# EAGLE design 2 layers (EAGLE 9.5.1)
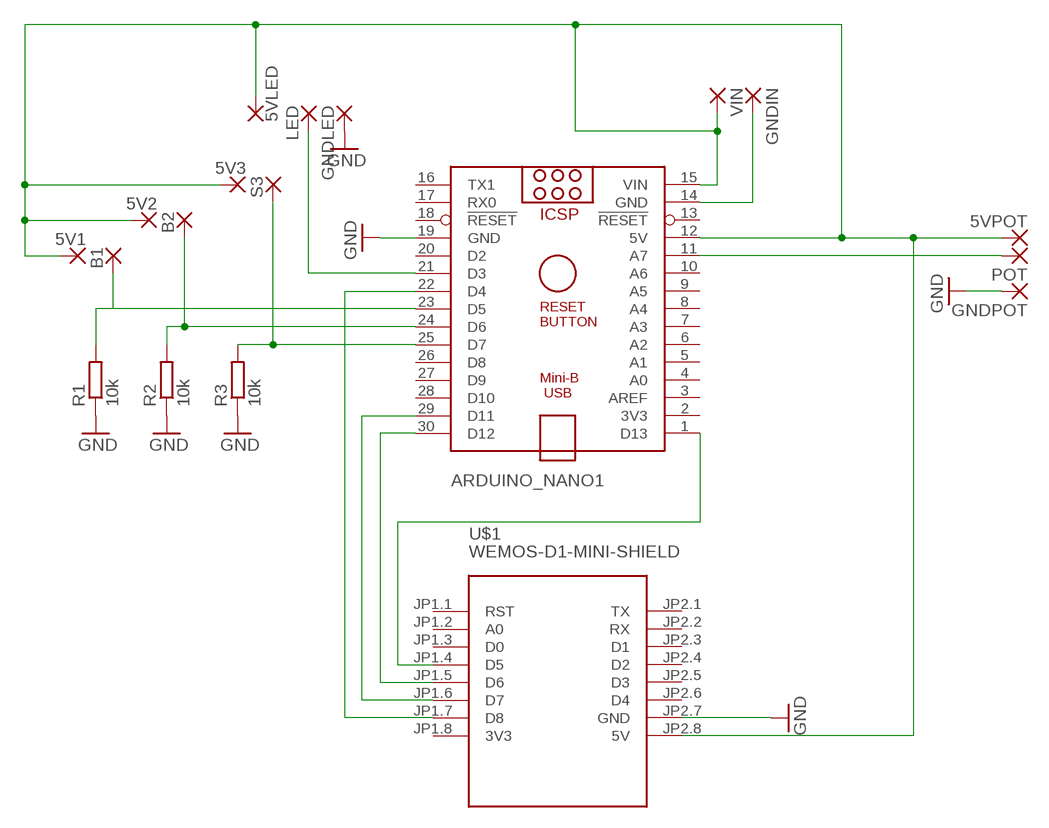
[diagram p0: schematic, sheet 1]

## Parts
5V1  1,6/0,8  [1,6/0,8]
5V2  1,6/0,8  [1,6/0,8]
5V3  1,6/0,8  [1,6/0,8]
5VLED  1,6/0,8  [1,6/0,8]
5VPOT  1,6/0,8  [1,6/0,8]
ARDUINO_NANO1  ARDUINO_NANO  [ARDUINO_NANO]
B1  1,6/0,8  [1,6/0,8]
B2  1,6/0,8  [1,6/0,8]
GNDIN  1,6/0,8  [1,6/0,8]
GNDLED  1,6/0,8  [1,6/0,8]
GNDPOT  1,6/0,8  [1,6/0,8]
LED  1,6/0,8  [1,6/0,8]
POT  1,6/0,8  [1,6/0,8]
R1  10k  R-EU_0207/7  [0207/7]
R2  10k  R-EU_0207/7  [0207/7]
R3  10k  R-EU_0207/7  [0207/7]
S3  1,6/0,8  [1,6/0,8]
U$1  WEMOS-D1-MINI-SHIELD  [WEMOS-D1-MINI-SHIELD]
VIN  1,6/0,8  [1,6/0,8]

## Nets
GND: ARDUINO_NANO1.19(GND) GNDLED.1(P) GNDPOT.1(P) R1.1 R2.1 R3.1 U$1.JP2.7(GND)
N$1: 5V1.1(P) 5V2.1(P) 5V3.1(P) 5VLED.1(P) 5VPOT.1(P) ARDUINO_NANO1.12(5V) ARDUINO_NANO1.15(VIN) U$1.JP2.8(5V) VIN.1(P)
N$2: ARDUINO_NANO1.14(GND) GNDIN.1(P)
N$3: ARDUINO_NANO1.11(A7) POT.1(P)
N$5: ARDUINO_NANO1.1(D13) U$1.JP1.4(D5)
N$6: ARDUINO_NANO1.30(D12) U$1.JP1.5(D6)
N$7: ARDUINO_NANO1.29(D11) U$1.JP1.6(D7)
N$8: ARDUINO_NANO1.25(D7) R3.2 S3.1(P)
N$9: ARDUINO_NANO1.22(D4) U$1.JP1.7(D8)
N$10: ARDUINO_NANO1.24(D6) B2.1(P) R2.2
N$11: ARDUINO_NANO1.23(D5) B1.1(P) R1.2
N$12: ARDUINO_NANO1.21(D3) LED.1(P)
Unconnected: ARDUINO_NANO1.2(3V3) ARDUINO_NANO1.3(AREF) ARDUINO_NANO1.4(A0) ARDUINO_NANO1.5(A1) ARDUINO_NANO1.6(A2) ARDUINO_NANO1.7(A3) ARDUINO_NANO1.8(A4) ARDUINO_NANO1.9(A5) ARDUINO_NANO1.10(A6) ARDUINO_NANO1.13(!RESET) ARDUINO_NANO1.16(TX1) ARDUINO_NANO1.17(RX0) ARDUINO_NANO1.18(!RESET) ARDUINO_NANO1.20(D2) ARDUINO_NANO1.26(D8) ARDUINO_NANO1.27(D9) ARDUINO_NANO1.28(D10) U$1.JP1.1(RST) U$1.JP1.2(A0) U$1.JP1.3(D0) U$1.JP2.1(TX) U$1.JP2.2(RX) U$1.JP2.3(D1) U$1.JP2.4(D2) U$1.JP2.5(D3) U$1.JP2.6(D4)

## Power pins joined to a net without a drawn wire
3V3: U$1.JP1.8(3V3)

## Library data of the parts
5V1-5V3 5VLED 5VPOT B1 B2 GNDIN GNDLED GNDPOT LED POT S3 VIN = wirepad:1,6/0,8: THROUGH-HOLE PAD
ARDUINO_NANO1 = ArduinoNanoV30:ARDUINO_NANO: Arduino Nano V3.0 Overview: The Arduino Nano is a small, complete, and breadboard-friendly board based on the ATmega328 (Arduino Nano 3.x) or ATmega168 (Arduino Nano 2.x). It has more or less the same functionality of the Arduino Duemilanove, but in a different package. It lacks only a DC power jack, and works with a Mini-B USB cable instead of a standard one. The Nano was designed and is being produced by Gravitech. Specifications: Microcontroller Atmel ATmega168 or ATmega328 Operating Voltage (logic level) 5 V Input Voltage (recommended) 7-12 V Input Voltage (limits) 6-20 V Digital I/O Pins 14 (of which 6 provide PWM output) Analog Input Pins 8 DC Current per I/O Pin 40 mA Flash Memory 16 KB (ATmega168) or 32 KB (ATmega328) of which 2 KB used by bootloader SRAM 1 KB (ATmega168) or 2 KB (ATmega328) EEPROM 512 bytes (ATmega168) or 1 KB (ATmega328) Clock Speed 16 MHz Dimensions 0.73" x 1.70" Length 45 mm Width 18 mm Weigth 5 g Power: The Arduino Nano can be powered via the Mini-B USB connection, 6-20V unregulated external power supply (pin 30), or 5V regulated external power supply (pin 27). The power source is automatically selected to the highest voltage source. Memory: The ATmega168 has 16 KB of flash memory for storing code (of which 2 KB is used for the bootloader); the ATmega328 has 32 KB, (also with 2 KB used for the bootloader). The ATmega168 has 1 KB of SRAM and 512 bytes of EEPROM (which can be read and written with the EEPROM library); the ATmega328 has 2 KB of SRAM and 1 KB of EEPROM. Input and Output: Each of the 14 digital pins on the Nano can be used as an input or output, using pinMode(), digitalWrite(), and digitalRead() functions. They operate at 5 volts. Each pin can provide or receive a maximum of 40 mA and has an internal pull-up resistor (disconnected by default) of 20-50 kOhms. In addition, some pins have specialized functions. Visit Arduino - ArduinoBoardNano <https://www.arduino.cc/en/Main/ArduinoBoardNano>
R1-R3 = resistor:R-EU_: RESISTOR, European symbol
U$1 = diy-modules:WEMOS-D1-MINI-SHIELD: Template for WEMOS D1 mini compatible shields NOTICE: This is a template only. You can use it as a base to create symbols for WEMOS D1 mini compatible shields. Official list of available shields can be found here: https://www.wemos.cc/D1-mini-Shields

## Net classes
0 default: width 0.4 mm, drill 0.6 mm, clearance 0.3 mm

## Board
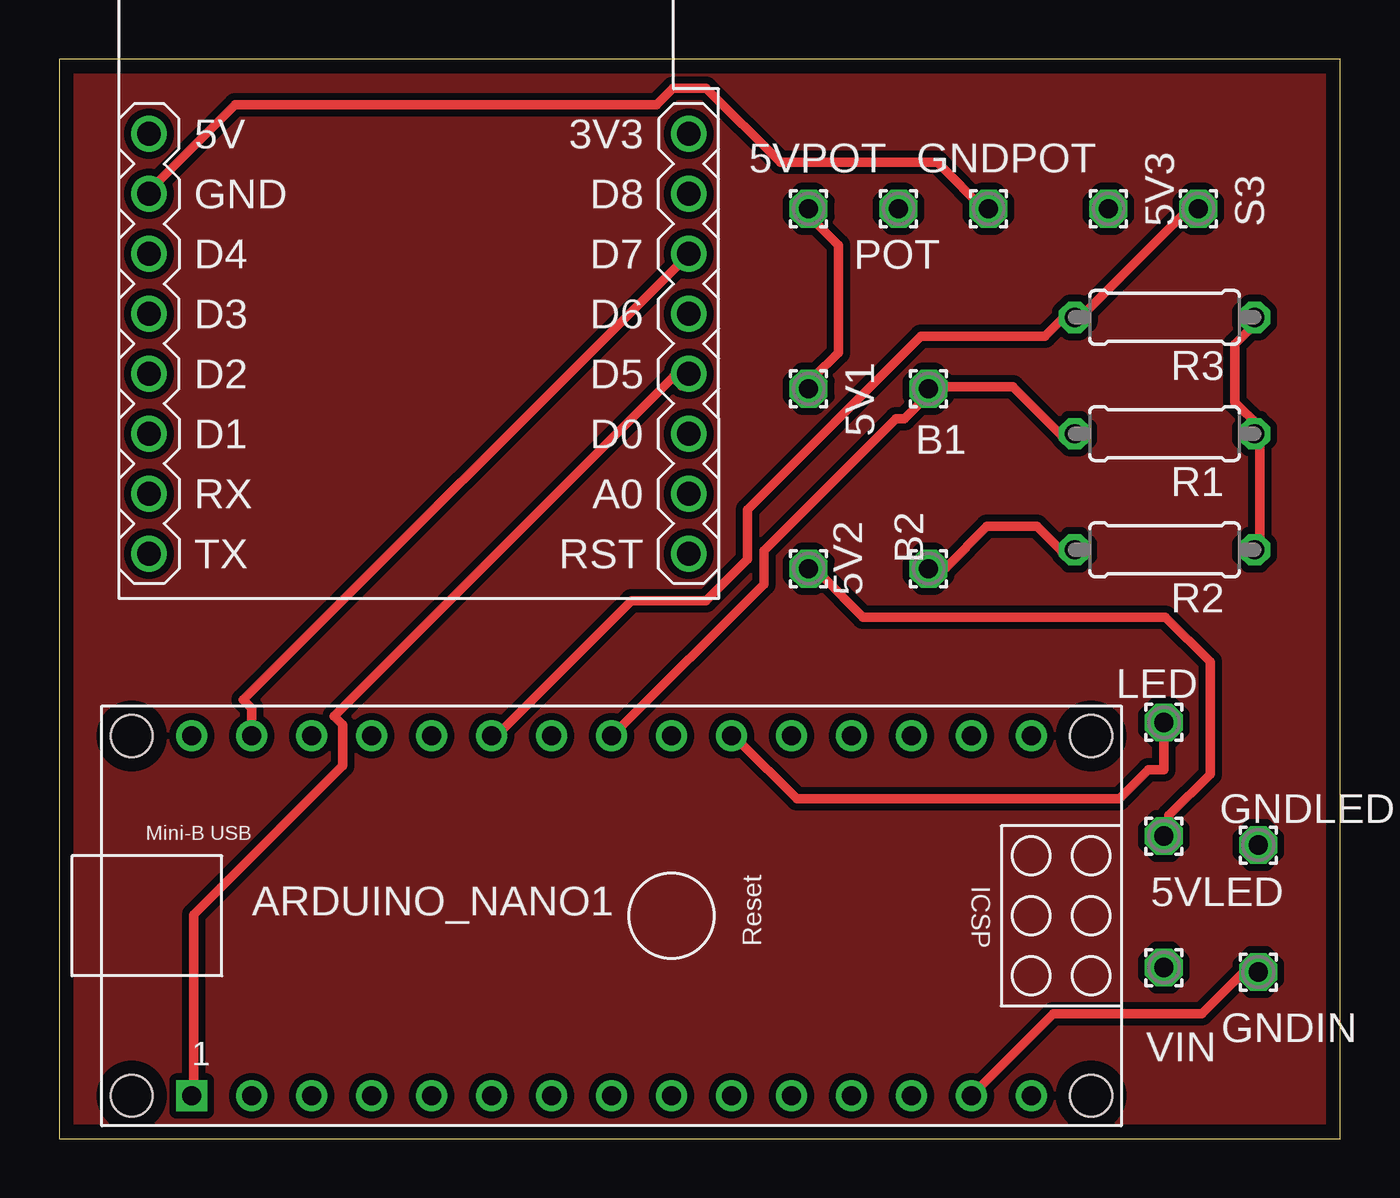
[diagram p1: board, top side]
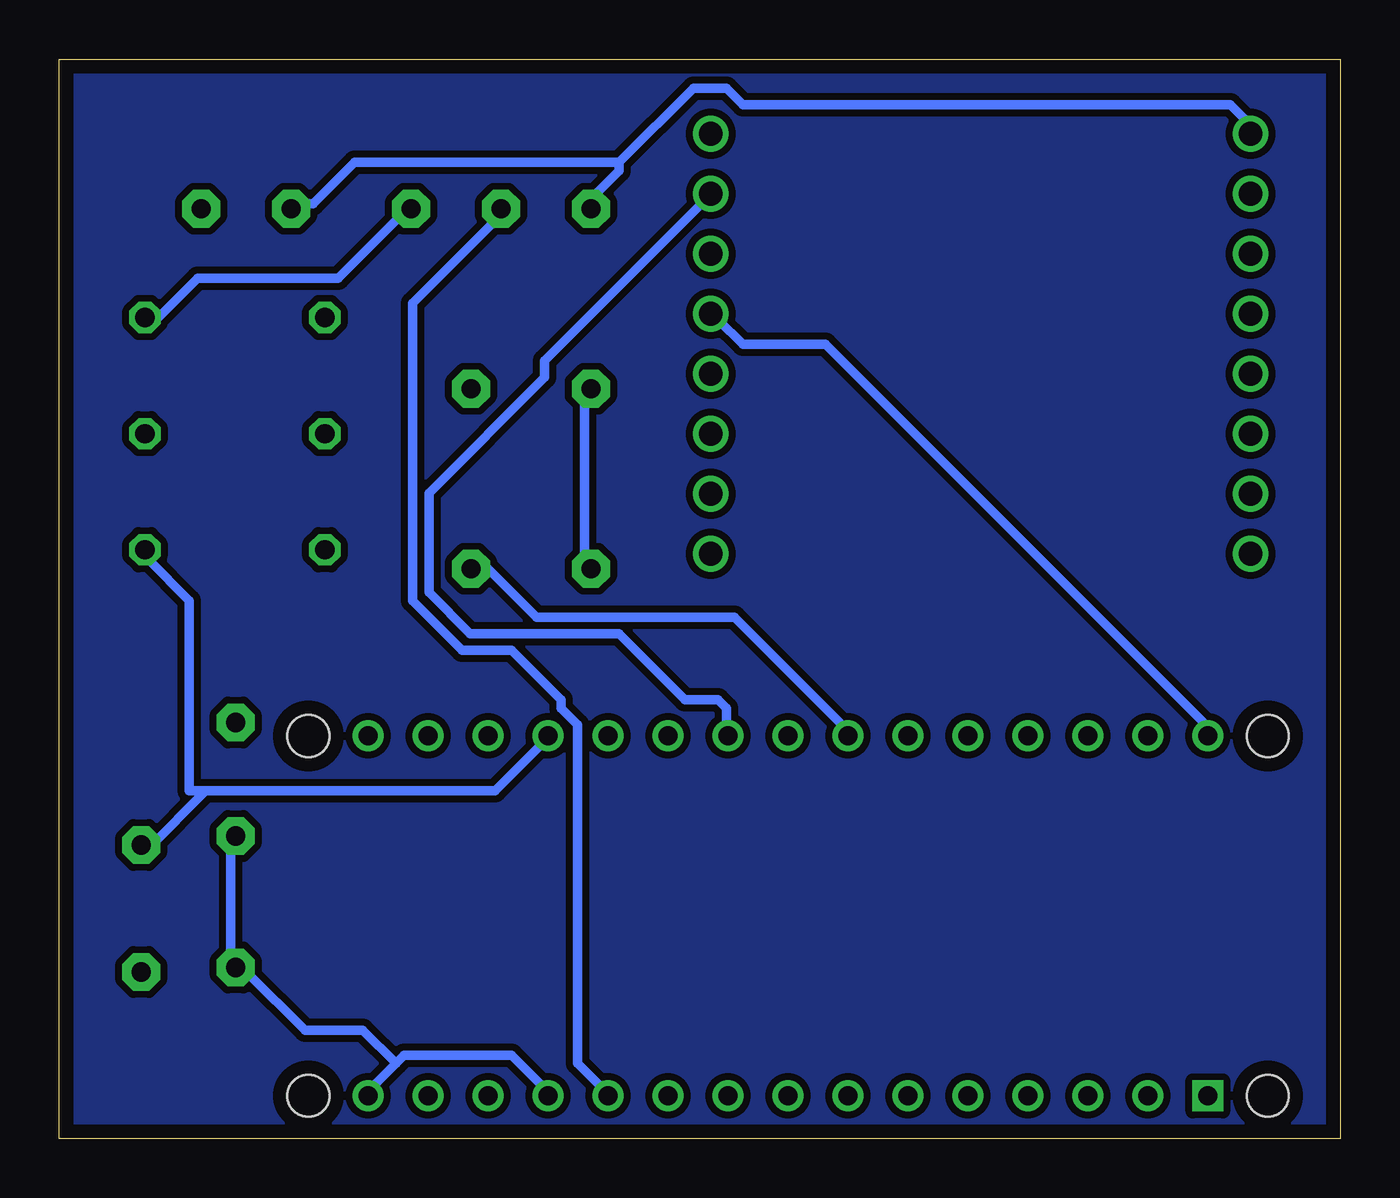
[diagram p2: board, bottom side, seen from below]

Size 54.28 x 45.71 mm. Coordinates in mm from the lower left corner, seen from the top.
Outline: 0,0 54.28,0 54.28,45.71 0,45.71 0,0
Copper layers (1*16): Top 0.035mm / dielectric 1.5mm / Bottom 0.035mm
Design rules "default *": minimum track width 0.4mm, minimum drill 0.6mm, track to track 0.3mm, track to pad 0.3mm, pad to pad 0.3mm, via to via 0.3mm, smd to smd 0.3mm, copper to edge 0.6mm, drill to drill 0.6mm, minimum pad ring 10mil, minimum via ring 8mil, stop-mask expansion 4mil, vias tented up to drill 0mil, thermal gap 10mil

### Footprints (pad centres in the part's own frame; a part is rotated, then mirrored left to right if it is on the bottom)
1,6/0,8 = drill 0.813 pad 1.6 octagon: 1 0,0
ARDUINO_NANO = drill 0.8 square: 1 -20.32,-7.62 | drill 0.8: 2 -17.78,-7.62; 3 -15.24,-7.62; 4 -12.7,-7.62; 5 -10.16,-7.62; 6 -7.62,-7.62; 7 -5.08,-7.62; 8 -2.54,-7.62; 9 0,-7.62; 10 2.54,-7.62; 11 5.08,-7.62; 12 7.62,-7.62; 13 10.16,-7.62; 14 12.7,-7.62; 15 15.24,-7.62; 16 15.24,7.62; 17 12.7,7.62; 18 10.16,7.62; 19 7.62,7.62; 20 5.08,7.62; 21 2.54,7.62; 22 0,7.62; 23 -2.54,7.62; 24 -5.08,7.62; 25 -7.62,7.62; 26 -10.16,7.62; 27 -12.7,7.62; 28 -15.24,7.62; 29 -17.78,7.62; 30 -20.32,7.62 | hole 1.778: -22.86,-7.62; -22.86,7.62; 17.78,7.62; 17.78,-7.62
0207/7 = drill 0.813 octagon: 1 -3.81,0; 2 3.81,0
WEMOS-D1-MINI-SHIELD = drill 1: JP1.1 -11.43,12.065; JP1.2 -11.43,9.525; JP1.3 -11.43,6.985; JP1.4 -11.43,4.445; JP1.5 -11.43,1.905; JP1.6 -11.43,-0.635; JP1.7 -11.43,-3.175; JP1.8 -11.43,-5.715; JP2.1 11.43,12.065; JP2.2 11.43,9.525; JP2.3 11.43,6.985; JP2.4 11.43,4.445; JP2.5 11.43,1.905; JP2.6 11.43,-0.635; JP2.7 11.43,-3.175; JP2.8 11.43,-5.715

### Placement (x,y rotation side)
5V1  31.75,31.75 0 top
5V2  31.75,24.13 0 top
5V3  44.45,39.37 0 top
5VLED  46.8,12.81 0 top
5VPOT  31.75,39.37 0 top
ARDUINO_NANO1  25.94,9.43 0 top
B1  36.83,31.75 0 top
B2  36.83,24.13 0 top
GNDIN  50.8,7.05 0 top
GNDLED  50.8,12.43 0 top
GNDPOT  39.37,39.37 0 top
LED  46.8,17.62 0 top
POT  35.56,39.37 0 top
R1  46.83,29.85 180 top
R2  46.83,24.93 180 top
R3  46.83,34.77 180 top
S3  48.26,39.37 0 top
U$1  15.24,36.83 180 top
VIN  46.8,7.24 0 top

### Tracks (layer width: path | path; a pad name or v marks a point on that pad's centre or on a via)
1
  pour Top: 0,45.72 54.61,45.72 54.61,0 0,0
2
  pour Bottom: 0,45.72 0,0 54.61,0 54.61,45.72
GND
  Top 0.4: U$1.JP2.7 3.96,40.28 7.46,43.78 25.31,43.78 26.01,44.48 27.41,44.48 30.56,41.33 37.21,41.33 39.31,39.23 GNDPOT.1 | R2.1 50.86,25.23 50.86,29.78 R1.1 50.86,30.13 49.81,31.18 49.81,33.63 50.51,34.33 50.51,34.68 R3.1
  Bottom 0.4: 48.06,14.73 48.76,14.73 48.76,22.78 50.51,24.53 50.51,24.88 R2.1 | 48.06,14.73 35.81,14.73 33.71,16.83 ARDUINO_NANO1.19 | 48.06,14.73 50.51,12.28 GNDLED.1 | GNDPOT.1 39.66,39.23 42.46,36.43 48.41,36.43 50.51,34.33 50.86,34.68 R3.1
N$1
  Top 0.4: 5V1.1 31.96,31.88 31.96,32.23 33.01,33.28 33.01,37.83 31.61,39.23 5VPOT.1 | 5VLED.1 47.01,12.98 47.01,13.68 48.76,15.43 48.76,20.18 46.86,22.08 34.06,22.08 32.31,23.83 32.31,24.18 31.96,24.18 5V2.1
  Bottom 0.4: 5VLED.1 46.66,12.63 47.01,12.28 47.01,7.38 VIN.1 46.66,7.03 46.31,7.03 43.86,4.58 41.41,4.58 40.01,3.18 | 40.01,3.18 41.06,2.13 ARDUINO_NANO1.15 | 40.01,3.18 39.66,3.53 35.11,3.53 33.71,2.13 ARDUINO_NANO1.12 | 5V2.1 31.96,24.18 32.01,24.23 32.01,31.13 31.61,31.53 5V1.1 | 30.56,41.33 27.41,44.48 26.01,44.48 25.31,43.78 4.66,43.78 3.96,43.08 3.96,42.73 U$1.JP2.8 | 30.56,41.33 30.56,40.98 31.96,39.58 5VPOT.1 | 30.56,41.33 41.76,41.33 43.51,39.58 44.21,39.58 5V3.1
N$2
  Top 0.4: ARDUINO_NANO1.14 42.11,5.28 48.41,5.28 50.51,7.38 GNDIN.1
N$3
  Bottom 0.4: ARDUINO_NANO1.11 31.26,2.13 32.31,3.18 32.31,17.53 33.01,18.23 33.01,18.58 35.11,20.68 37.21,20.68 39.31,22.78 39.31,35.38 35.46,39.23 POT.1
N$5
  Top 0.4: ARDUINO_NANO1.1 5.71,2.13 5.71,9.48 12.01,15.78 12.01,17.53 11.66,17.88 26.01,32.23 26.36,31.88 26.71,31.88 26.71,32.23 U$1.JP1.4
N$6
  Bottom 0.4: ARDUINO_NANO1.30 5.71,17.18 5.71,17.53 21.81,33.63 25.31,33.63 26.36,34.68 U$1.JP1.5
N$7
  Top 0.4: ARDUINO_NANO1.29 8.16,18.23 7.81,18.58 26.36,37.13 U$1.JP1.6
N$8
  Top 0.4: ARDUINO_NANO1.25 18.66,17.18 24.26,22.78 27.41,22.78 29.16,24.53 29.16,26.63 36.51,33.98 41.76,33.98 42.81,35.03 R3.2 42.81,34.68 43.16,34.33 43.51,34.68 43.51,35.03 47.71,39.23 48.06,39.23 S3.1
N$9
  Bottom 0.4: ARDUINO_NANO1.22 26.01,17.18 26.01,18.23 26.36,18.58 27.76,18.58 30.56,21.38 36.86,21.38 38.61,23.13 38.61,27.33 33.71,32.23 33.71,32.93 27.06,39.58 26.71,39.58 26.36,39.93 U$1.JP1.7
N$10
  Top 0.4: R2.2 42.81,24.88 42.46,24.88 41.41,25.93 39.31,25.93 37.56,24.18 36.86,24.18 B2.1
  Bottom 0.4: ARDUINO_NANO1.24 21.11,17.18 21.11,17.53 25.66,22.08 34.06,22.08 36.51,24.53 36.86,24.18 B2.1
N$11
  Top 0.4: ARDUINO_NANO1.23 23.56,17.18 29.86,23.48 29.86,24.88 35.46,30.48 35.81,30.48 36.51,31.18 36.86,31.18 36.86,31.53 B1.1 36.86,31.88 36.91,31.83 40.41,31.83 42.46,29.78 42.81,29.78 R1.2
N$12
  Top 0.4: ARDUINO_NANO1.21 28.81,16.83 31.26,14.38 44.91,14.38 46.15,15.62 46.8,15.62 LED.1